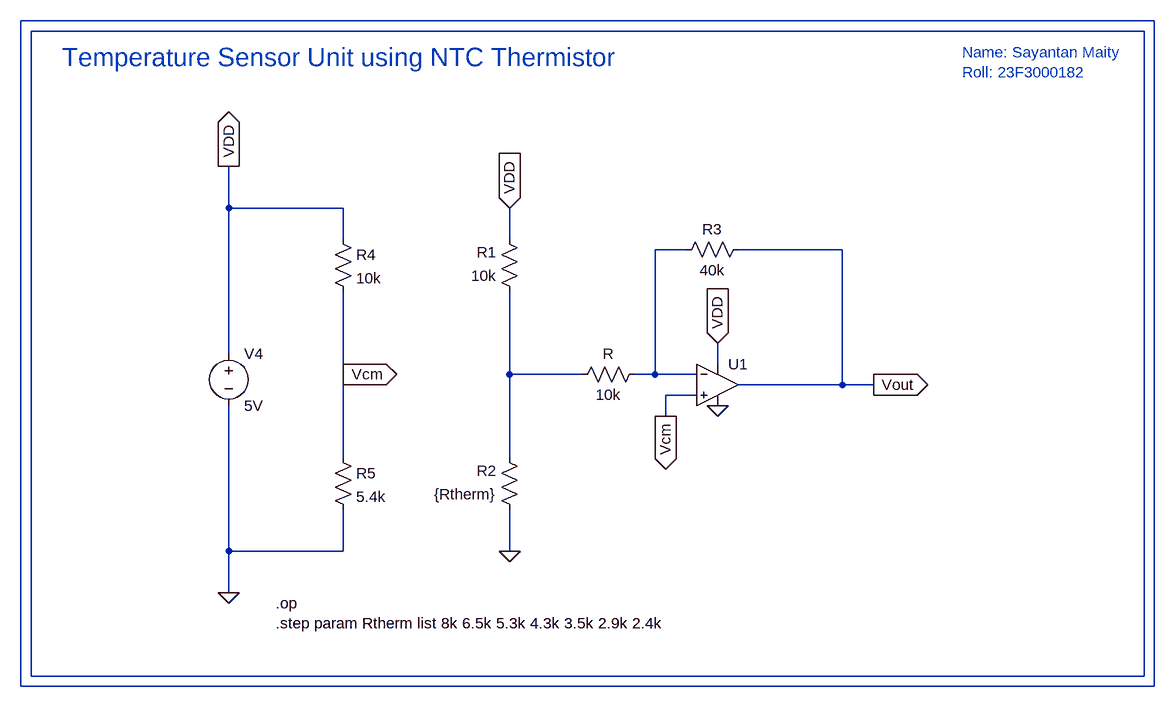
[diagram p0: schematic Draft1.asc]
Draft1.asc, the LTspice schematic file:
Version 4.1
SHEET 1 1088 756
WIRE 560 -272 -1184 -272
WIRE 544 -256 -1168 -256
WIRE -864 16 -864 -48
WIRE -688 16 -864 16
WIRE -688 64 -688 16
WIRE -432 64 -432 16
WIRE -160 80 -208 80
WIRE 80 80 -80 80
WIRE -864 240 -864 16
WIRE -112 256 -112 224
WIRE -688 272 -688 144
WIRE -432 272 -432 144
WIRE -320 272 -432 272
WIRE -208 272 -208 80
WIRE -208 272 -240 272
WIRE -144 272 -208 272
WIRE 80 288 80 80
WIRE 80 288 -80 288
WIRE 128 288 80 288
WIRE -144 304 -192 304
WIRE -192 336 -192 304
WIRE -688 400 -688 272
WIRE -432 400 -432 272
WIRE -864 544 -864 320
WIRE -688 544 -688 480
WIRE -688 544 -864 544
WIRE -432 544 -432 480
WIRE -864 608 -864 544
WIRE -1168 736 -1168 -256
WIRE 544 736 544 -256
WIRE 544 736 -1168 736
WIRE -1184 752 -1184 -272
WIRE 560 752 560 -272
WIRE 560 752 -1184 752
FLAG -112 320 0
FLAG -864 608 0
FLAG -864 -48 VDD
IOPIN -864 -48 Out
FLAG -432 544 0
FLAG -688 272 Vcm
IOPIN -688 272 Out
FLAG -112 224 VDD
IOPIN -112 224 In
FLAG -432 16 VDD
IOPIN -432 16 In
FLAG -192 336 Vcm
IOPIN -192 336 Out
FLAG 128 288 Vout
IOPIN 128 288 Out
SYMBOL res -416 160 R180
WINDOW 0 36 76 Left 2
WINDOW 3 36 40 Left 2
SYMATTR InstName R1
SYMATTR Value 10k
SYMBOL res -416 496 R180
WINDOW 0 36 76 Left 2
WINDOW 3 36 40 Left 2
SYMATTR InstName R2
SYMATTR Value {Rtherm}
SYMBOL res -64 64 R90
WINDOW 0 0 56 VBottom 2
WINDOW 3 32 56 VTop 2
SYMATTR InstName R3
SYMATTR Value 40k
SYMBOL res -224 256 R90
WINDOW 0 0 56 VBottom 2
WINDOW 3 32 56 VTop 2
SYMATTR InstName R
SYMATTR Value 10k
SYMBOL OpAmps\\UniversalOpAmp -112 288 R0
SYMATTR InstName U1
SYMBOL voltage -864 224 R0
SYMATTR InstName V4
SYMATTR Value 5V
SYMBOL res -704 48 R0
SYMATTR InstName R4
SYMATTR Value 10k
SYMBOL res -704 384 R0
SYMATTR InstName R5
SYMATTR Value 5.4k
TEXT -792 624 Left 2 !.op\n.step param Rtherm list 8k 6.5k 5.3k 4.3k 3.5k 2.9k 2.4k
TEXT -1120 -216 Left 4 ;Temperature Sensor Unit using NTC Thermistor
TEXT 264 -224 Left 2 ;Name: Sayantan Maity\nRoll: 23F3000182

The netlist it stands for:
* Draft1.asc
R1 N004 VDD 10k
R2 0 N004 {Rtherm}
R3 Vout N003 40k
R N003 N004 10k
X§U1 Vcm N003 VDD 0 Vout level1 Avol=1Meg GBW=10Meg Vos=0 En=0 Enk=0 In=0 Ink=0 Rin=500Meg  ; pins In+ In- V+ V- OUT
V4 VDD 0 5V
R4 VDD Vcm 10k
R5 Vcm 0 5.4k
.op
.step param Rtherm list 8k 6.5k 5.3k 4.3k 3.5k 2.9k 2.4k
* Temperature Sensor Unit using NTC Thermistor
* Name: Sayantan Maity
* Roll: 23F3000182
.lib UniversalOpAmp1.lib
.backanno
.end